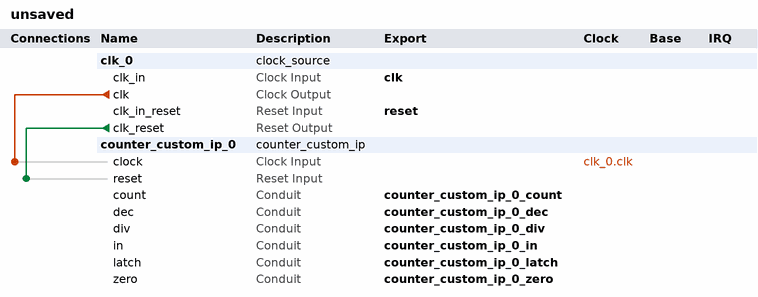
[diagram p0: system contents]
# Platform Designer (Qsys) system unsaved, Cyclone V 5CGXFC7C7F23C8
# Parameters at their usual value, and those the tool derives, are not listed.
package require -exact qsys 22.1
create_system unsaved
set_project_property DEVICE_FAMILY {Cyclone V}
set_project_property DEVICE 5CGXFC7C7F23C8

add_instance clk_0 clock_source 22.1
set_instance_parameter_value clk_0 clockFrequency 2000000

add_instance counter_custom_ip_0 counter_custom_ip 1.0

# connections
add_connection clk_0.clk counter_custom_ip_0.clock clock
add_connection clk_0.clk_reset counter_custom_ip_0.reset reset

# exported interfaces
add_interface clk clock sink
set_interface_property clk EXPORT_OF clk_0.clk_in
add_interface counter_custom_ip_0_count conduit end
set_interface_property counter_custom_ip_0_count EXPORT_OF counter_custom_ip_0.count
add_interface counter_custom_ip_0_dec conduit end
set_interface_property counter_custom_ip_0_dec EXPORT_OF counter_custom_ip_0.dec
add_interface counter_custom_ip_0_div conduit end
set_interface_property counter_custom_ip_0_div EXPORT_OF counter_custom_ip_0.div
add_interface counter_custom_ip_0_in conduit end
set_interface_property counter_custom_ip_0_in EXPORT_OF counter_custom_ip_0.in
add_interface counter_custom_ip_0_latch conduit end
set_interface_property counter_custom_ip_0_latch EXPORT_OF counter_custom_ip_0.latch
add_interface counter_custom_ip_0_zero conduit end
set_interface_property counter_custom_ip_0_zero EXPORT_OF counter_custom_ip_0.zero
add_interface reset reset sink
set_interface_property reset EXPORT_OF clk_0.clk_in_reset

set_interconnect_requirement {$system} qsys_mm.clockCrossingAdapter HANDSHAKE
set_interconnect_requirement {$system} qsys_mm.enableEccProtection FALSE
set_interconnect_requirement {$system} qsys_mm.insertDefaultSlave FALSE
set_interconnect_requirement {$system} qsys_mm.maxAdditionalLatency 1

save_system unsaved.qsys
